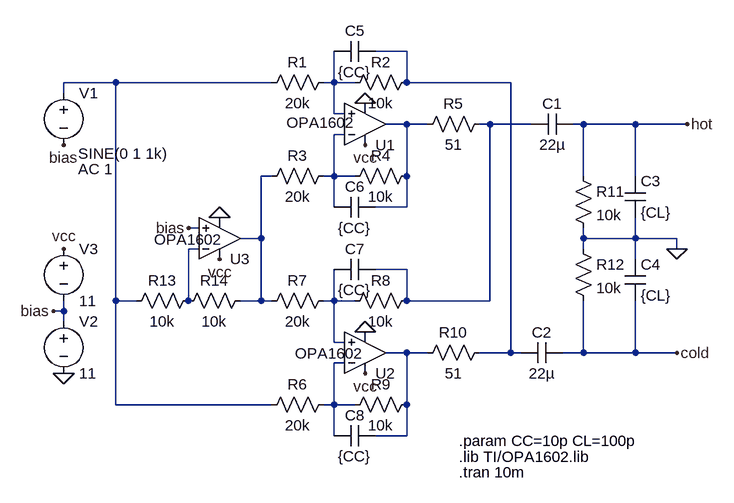
[diagram p0: schematic LineDriver-tran.asc]
LineDriver-tran.asc, the LTspice schematic file:
Version 4
SHEET 1 880 680
WIRE -464 -576 -512 -576
WIRE -912 -528 -992 -528
WIRE -672 -528 -912 -528
WIRE -576 -528 -576 -576
WIRE -576 -528 -592 -528
WIRE -544 -528 -576 -528
WIRE -464 -528 -464 -576
WIRE -304 -528 -464 -528
WIRE -992 -512 -992 -528
WIRE -576 -480 -576 -528
WIRE -560 -480 -576 -480
WIRE -464 -464 -496 -464
WIRE -432 -464 -464 -464
WIRE -336 -464 -352 -464
WIRE -272 -464 -336 -464
WIRE -192 -464 -208 -464
WIRE -112 -464 -192 -464
WIRE -32 -464 -112 -464
WIRE -560 -448 -576 -448
WIRE -672 -384 -688 -384
WIRE -576 -384 -576 -448
WIRE -576 -384 -592 -384
WIRE -544 -384 -576 -384
WIRE -464 -384 -464 -464
WIRE -192 -384 -192 -464
WIRE -112 -384 -112 -464
WIRE -576 -336 -576 -384
WIRE -464 -336 -464 -384
WIRE -464 -336 -512 -336
WIRE -784 -304 -800 -304
WIRE -688 -288 -688 -384
WIRE -688 -288 -720 -288
WIRE -192 -288 -192 -304
WIRE -112 -288 -112 -320
WIRE -112 -288 -192 -288
WIRE -48 -288 -112 -288
WIRE -784 -272 -800 -272
WIRE -192 -272 -192 -288
WIRE -48 -272 -48 -288
WIRE -112 -256 -112 -288
WIRE -464 -240 -512 -240
WIRE -912 -192 -912 -528
WIRE -880 -192 -912 -192
WIRE -800 -192 -800 -272
WIRE -688 -192 -688 -288
WIRE -688 -192 -720 -192
WIRE -672 -192 -688 -192
WIRE -576 -192 -576 -240
WIRE -576 -192 -592 -192
WIRE -544 -192 -576 -192
WIRE -464 -192 -464 -240
WIRE -336 -192 -336 -464
WIRE -336 -192 -464 -192
WIRE -992 -176 -992 -192
WIRE -992 -176 -1008 -176
WIRE -992 -160 -992 -176
WIRE -576 -128 -576 -192
WIRE -560 -128 -576 -128
WIRE -464 -112 -496 -112
WIRE -432 -112 -464 -112
WIRE -304 -112 -304 -528
WIRE -304 -112 -352 -112
WIRE -288 -112 -304 -112
WIRE -192 -112 -192 -192
WIRE -192 -112 -224 -112
WIRE -112 -112 -112 -192
WIRE -112 -112 -192 -112
WIRE -48 -112 -112 -112
WIRE -560 -96 -576 -96
WIRE -912 -32 -912 -192
WIRE -672 -32 -912 -32
WIRE -576 -32 -576 -96
WIRE -576 -32 -592 -32
WIRE -544 -32 -576 -32
WIRE -464 -32 -464 -112
WIRE -576 16 -576 -32
WIRE -464 16 -464 -32
WIRE -464 16 -512 16
FLAG -48 -272 0
FLAG -32 -464 hot
FLAG -48 -112 cold
FLAG -992 -80 0
FLAG -1008 -176 bias
FLAG -800 -304 bias
FLAG -992 -272 vcc
FLAG -992 -432 bias
FLAG -528 -496 0
FLAG -528 -144 0
FLAG -752 -320 0
FLAG -528 -432 vcc
FLAG -528 -80 vcc
FLAG -752 -256 vcc
SYMBOL voltage -992 -528 R0
WINDOW 3 22 109 Left 2
WINDOW 123 22 133 Left 2
WINDOW 39 22 137 Left 2
SYMATTR Value SINE(0 1 1k)
SYMATTR Value2 AC 1
SYMATTR InstName V1
SYMBOL res -576 -544 R90
WINDOW 0 0 56 VBottom 2
WINDOW 3 32 56 VTop 2
SYMATTR InstName R1
SYMATTR Value 20k
SYMBOL res -448 -544 R90
WINDOW 0 0 56 VBottom 2
WINDOW 3 32 56 VTop 2
SYMATTR InstName R2
SYMATTR Value 10k
SYMBOL res -576 -400 R90
WINDOW 0 0 56 VBottom 2
WINDOW 3 32 56 VTop 2
SYMATTR InstName R3
SYMATTR Value 20k
SYMBOL res -448 -400 R90
WINDOW 0 0 56 VBottom 2
WINDOW 3 32 56 VTop 2
SYMATTR InstName R4
SYMATTR Value 10k
SYMBOL res -448 -448 R270
WINDOW 0 32 56 VTop 2
WINDOW 3 0 56 VBottom 2
SYMATTR InstName R5
SYMATTR Value 51
SYMBOL res -576 -48 R90
WINDOW 0 0 56 VBottom 2
WINDOW 3 32 56 VTop 2
SYMATTR InstName R6
SYMATTR Value 20k
SYMBOL res -576 -208 R90
WINDOW 0 0 56 VBottom 2
WINDOW 3 32 56 VTop 2
SYMATTR InstName R7
SYMATTR Value 20k
SYMBOL res -448 -208 R90
WINDOW 0 0 56 VBottom 2
WINDOW 3 32 56 VTop 2
SYMATTR InstName R8
SYMATTR Value 10k
SYMBOL res -448 -48 R90
WINDOW 0 0 56 VBottom 2
WINDOW 3 32 56 VTop 2
SYMATTR InstName R9
SYMATTR Value 10k
SYMBOL res -448 -96 R270
WINDOW 0 32 56 VTop 2
WINDOW 3 0 56 VBottom 2
SYMATTR InstName R10
SYMATTR Value 51
SYMBOL res -208 -400 R0
SYMATTR InstName R11
SYMATTR Value 10k
SYMBOL res -208 -288 R0
SYMATTR InstName R12
SYMATTR Value 10k
SYMBOL cap -272 -448 R270
WINDOW 0 32 32 VTop 2
WINDOW 3 0 32 VBottom 2
SYMATTR InstName C1
SYMATTR Value 22µ
SYMBOL cap -288 -96 R270
WINDOW 0 32 32 VTop 2
WINDOW 3 0 32 VBottom 2
SYMATTR InstName C2
SYMATTR Value 22µ
SYMBOL res -784 -208 R90
WINDOW 0 0 56 VBottom 2
WINDOW 3 32 56 VTop 2
SYMATTR InstName R13
SYMATTR Value 10k
SYMBOL res -704 -208 R90
WINDOW 0 0 56 VBottom 2
WINDOW 3 32 56 VTop 2
SYMATTR InstName R14
SYMATTR Value 10k
SYMBOL voltage -992 -176 R0
WINDOW 123 0 0 Left 0
WINDOW 39 0 0 Left 0
SYMATTR InstName V2
SYMATTR Value 11
SYMBOL Opamps\\opamp2 -528 -400 M180
WINDOW 3 -121 66 Left 2
SYMATTR Value OPA1602
SYMATTR InstName U1
SYMBOL Opamps\\opamp2 -528 -48 M180
WINDOW 3 -108 63 Left 2
SYMATTR Value OPA1602
SYMATTR InstName U2
SYMBOL Opamps\\opamp2 -752 -224 M180
WINDOW 3 -101 62 Left 2
SYMATTR Value OPA1602
SYMATTR InstName U3
SYMBOL voltage -992 -288 R0
WINDOW 123 0 0 Left 0
WINDOW 39 0 0 Left 0
SYMATTR InstName V3
SYMATTR Value 11
SYMBOL cap -128 -384 R0
SYMATTR InstName C3
SYMATTR Value {CL}
SYMBOL cap -128 -256 R0
SYMATTR InstName C4
SYMATTR Value {CL}
SYMBOL cap -512 -592 R90
WINDOW 0 0 32 VBottom 2
WINDOW 3 32 32 VTop 2
SYMATTR InstName C5
SYMATTR Value {CC}
SYMBOL cap -512 -352 R90
WINDOW 0 0 32 VBottom 2
WINDOW 3 32 32 VTop 2
SYMATTR InstName C6
SYMATTR Value {CC}
SYMBOL cap -512 -256 R90
WINDOW 0 0 32 VBottom 2
WINDOW 3 32 32 VTop 2
SYMATTR InstName C7
SYMATTR Value {CC}
SYMBOL cap -512 0 R90
WINDOW 0 0 32 VBottom 2
WINDOW 3 32 32 VTop 2
SYMATTR InstName C8
SYMATTR Value {CC}
TEXT -384 72 Left 2 !.tran 10m
TEXT -384 24 Left 2 !.param CC=10p CL=100p
TEXT -384 48 Left 2 !.lib TI/OPA1602.lib

The netlist it stands for:
* LineDriver-tran.asc
V1 N002 bias SINE(0 1 1k) AC 1
R1 N003 N002 20k
R2 N001 N003 10k
R3 N006 N007 20k
R4 N004 N006 10k
R5 N004 N005 51
R6 N011 N002 20k
R7 N009 N007 20k
R8 N005 N009 10k
R9 N010 N011 10k
R10 N010 N001 51
R11 hot 0 10k
R12 0 cold 10k
C1 N005 hot 22µ
C2 N001 cold 22µ
R13 N008 N002 10k
R14 N007 N008 10k
V2 bias 0 11
XU1 N003 N006 vcc 0 N004 OPA1602  ; pins In+ In- V+ V- OUT
XU2 N009 N011 vcc 0 N010 OPA1602  ; pins In+ In- V+ V- OUT
XU3 bias N008 vcc 0 N007 OPA1602  ; pins In+ In- V+ V- OUT
V3 vcc bias 11
C3 hot 0 {CL}
C4 0 cold {CL}
C5 N001 N003 {CC}
C6 N004 N006 {CC}
C7 N005 N009 {CC}
C8 N010 N011 {CC}
.tran 10m
.param CC=10p CL=100p
.lib TI/OPA1602.lib
.backanno
.end